# EasyEDA schematic Power-Supply-lm2576.json
TITLE: Sheet_1; REV: 1.0; Date: 2025-02-27; Sheet: 1/1; Drawn By: helmut-f; Company: Your Company
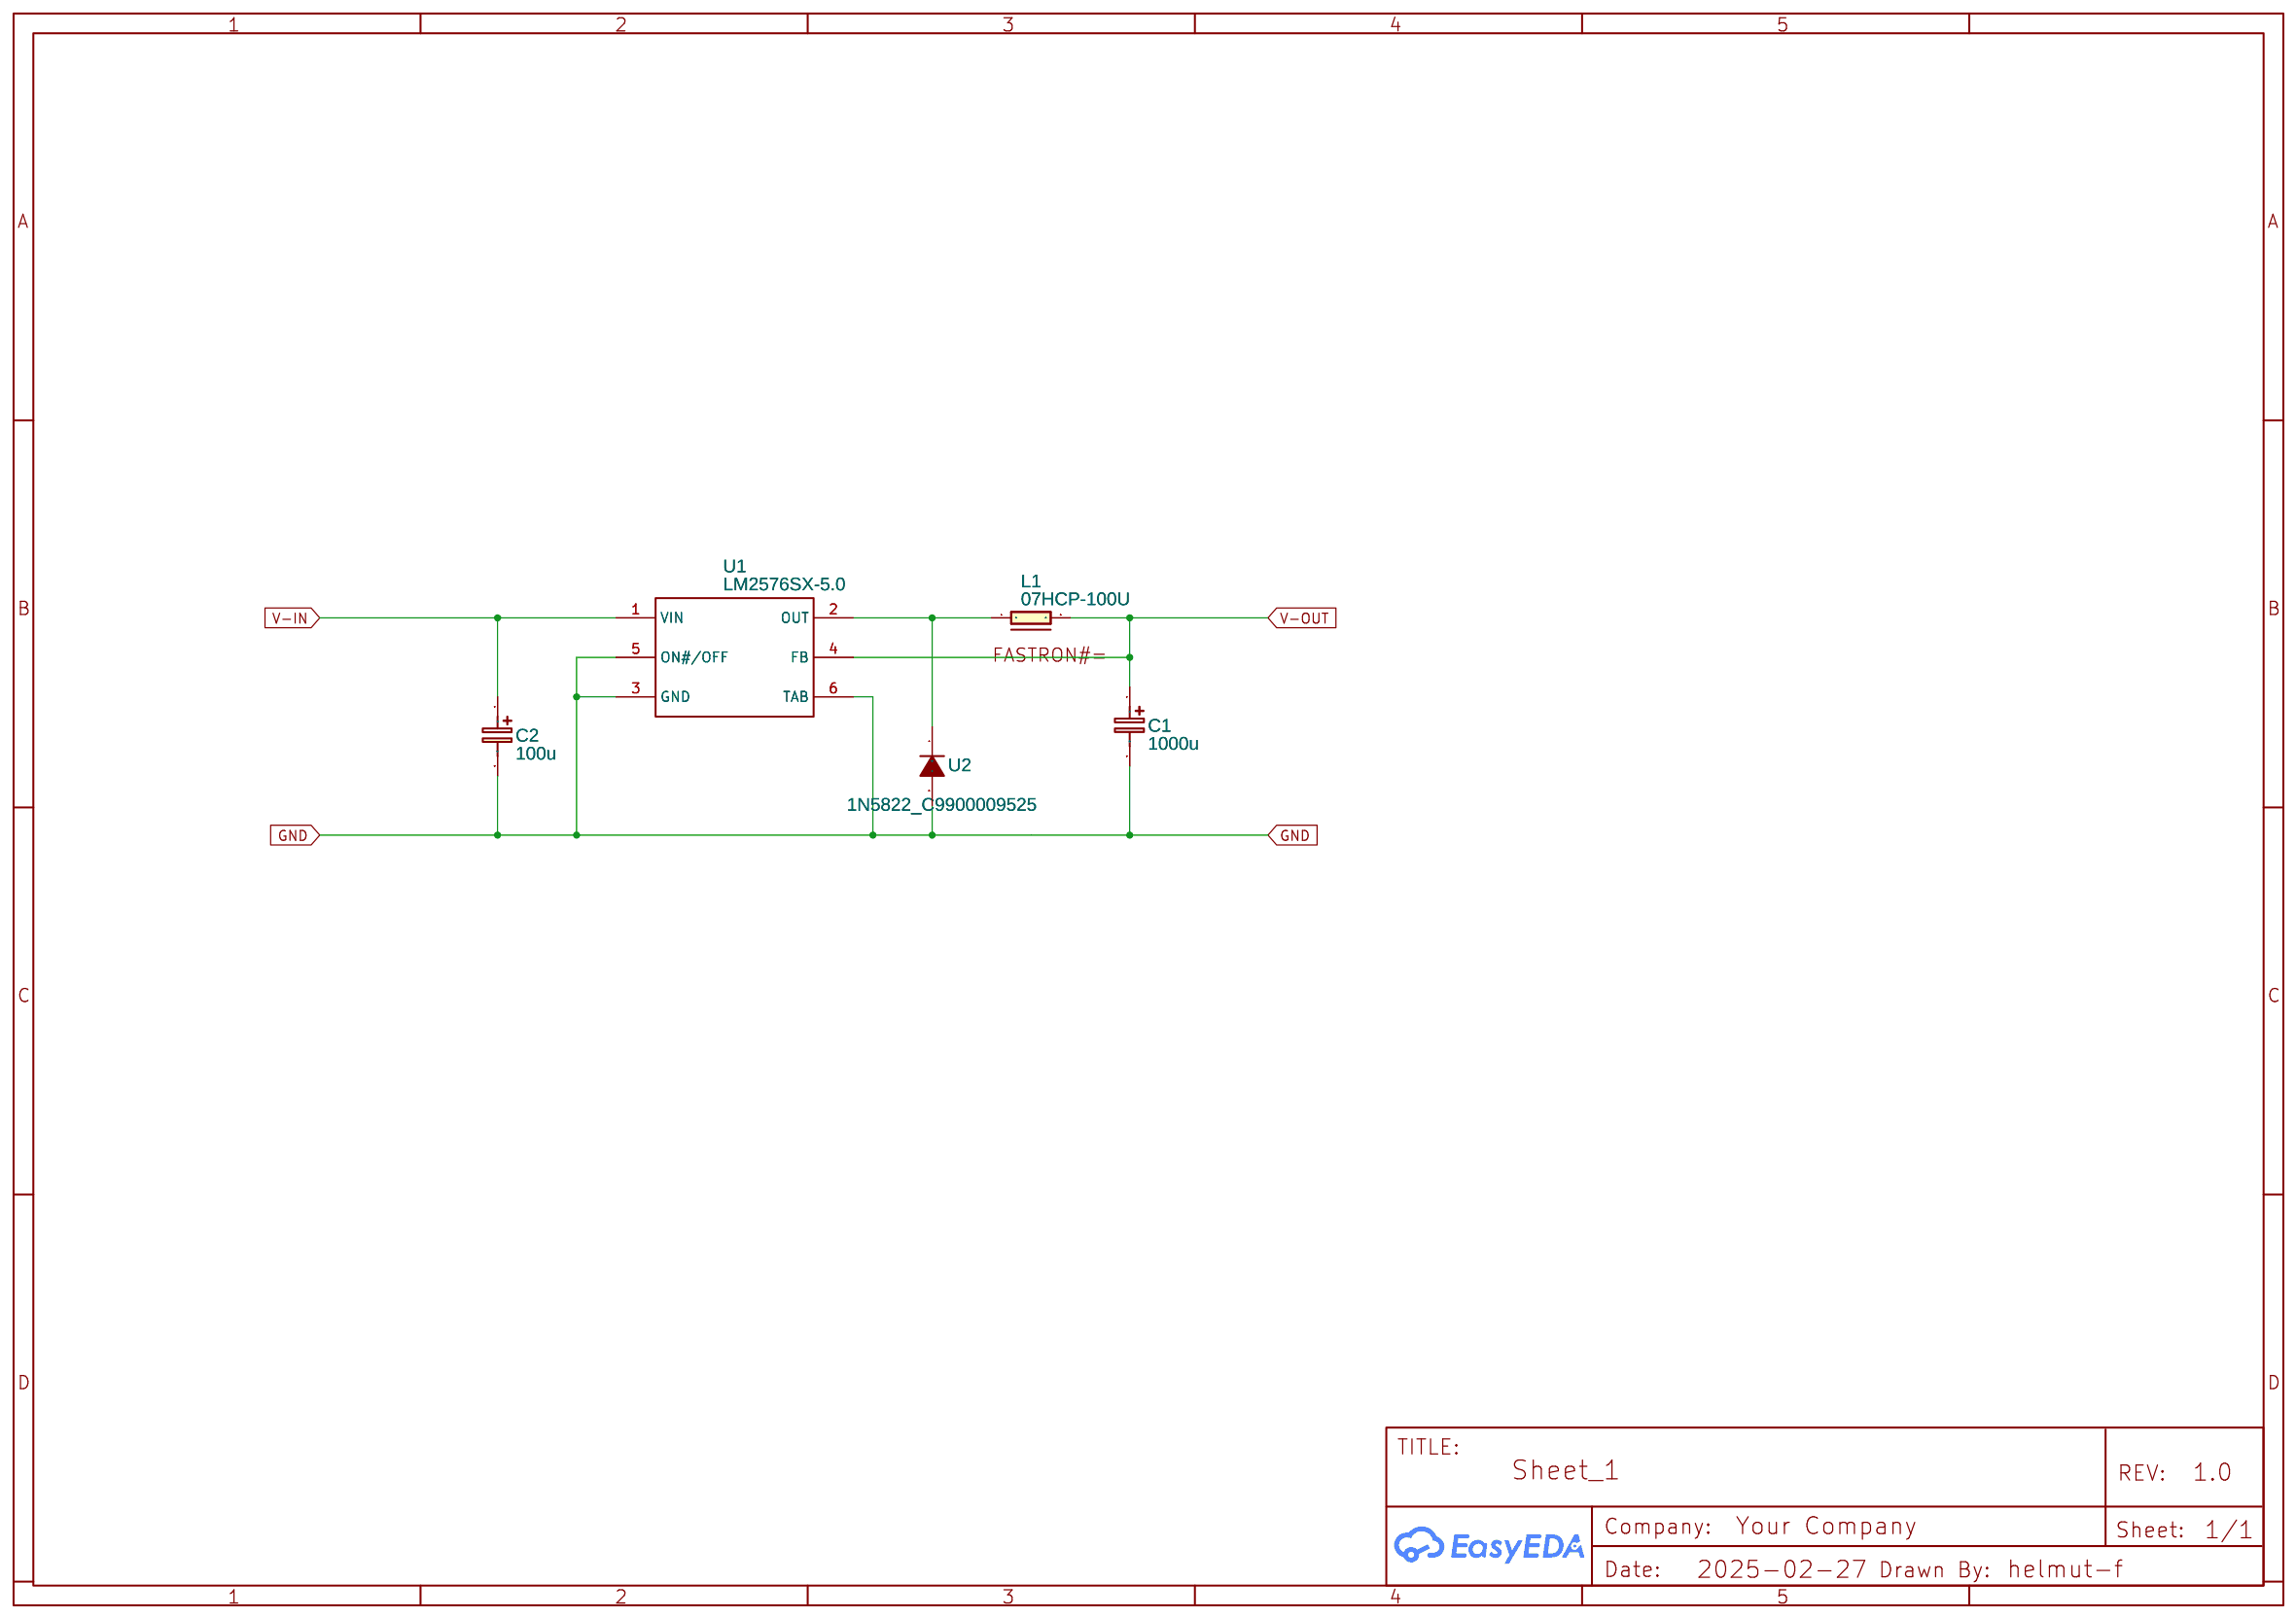
[diagram p0: schematic sheet]

## Parts
C1  1000u  [CAP-D8.0×H10.5]
C2  100u  [CAP-D8.0×H10.5]
L1  07HCP-100U  [FASTRON_07HCP_INDUCTOR]
U1  LM2576SX-5.0  [PG-TO-263-5_L10.2-W8.7-P1.70-LS14.4-BR]
U2  1N5822_C9900009525  [SMA_L4.3-W2.5-LS5.0-RD]

## Library data of the parts
C1 C2 = CE_SMD_D8.0×H10.5_EU: Contributor: LCEDA_Lib
L1 = 07HCP-100U
U1 = LM2576SX-5.0: Supplier: LCSC; Manufacturer: TI(德州仪器); Manufacturer Part: LM2576SX-5.0/NOPB; Supplier Part: C34465; JLCPCB Part Class: Extended Part
U2 = 1N5822_C9900009525: Contributor: LCSC; Supplier: LCSC; Supplier Part: C9900009525; Manufacturer: null; Manufacturer Part: 1N5822; JLCPCB Part Class: Extended Part

## Nets
GND: C1.2 C2.2 U1.3(GND) U1.5(ON#/OFF) U1.6(TAB) U2.2(A)
V-IN: C2.1 U1.1(VIN)
V-OUT: C1.1 L1.2 U1.4(FB)
Net-(L1-1): L1.1 U1.2(OUT) U2.1(C)
